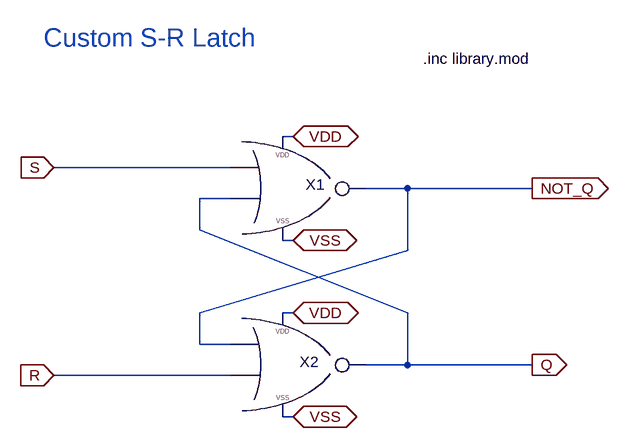
[diagram p0: schematic my_sr_latch.asc]
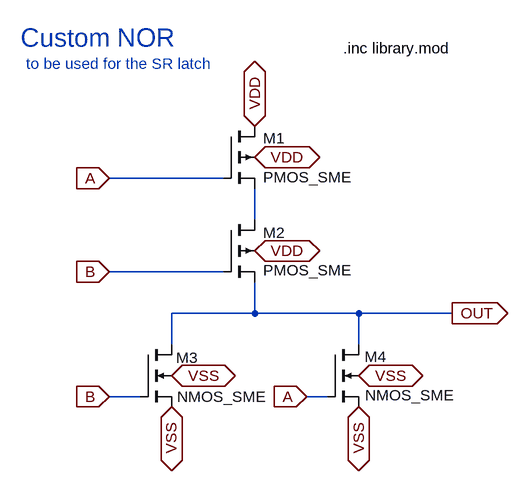
[diagram p1: sub-circuit my_nor.asc]
my_sr_latch.asc, the LTspice schematic file:
Version 4.1
SHEET 1 1044 728
WIRE 352 192 336 192
WIRE 256 240 -16 240
WIRE 528 272 464 272
WIRE 720 272 528 272
WIRE 256 288 208 288
WIRE 208 336 208 288
WIRE 352 352 336 352
WIRE 528 368 528 272
WIRE 208 464 528 368
WIRE 352 464 336 464
WIRE 528 464 208 336
WIRE 208 512 208 464
WIRE 256 512 208 512
WIRE 528 544 528 464
WIRE 528 544 464 544
WIRE 720 544 528 544
WIRE 256 560 -16 560
WIRE 352 624 336 624
FLAG -16 240 S
IOPIN -16 240 In
FLAG -16 560 R
IOPIN -16 560 In
FLAG 720 544 Q
IOPIN 720 544 Out
FLAG 720 272 NOT_Q
IOPIN 720 272 Out
FLAG 352 192 VDD
IOPIN 352 192 BiDir
FLAG 352 624 VSS
IOPIN 352 624 BiDir
FLAG 352 352 VSS
IOPIN 352 352 BiDir
FLAG 352 464 VDD
IOPIN 352 464 BiDir
SYMBOL my_nor 352 272 R0
WINDOW 0 34 10 Bottom 2
SYMATTR InstName X1
SYMBOL my_nor 352 544 R0
WINDOW 0 25 11 Bottom 2
SYMATTR InstName X2
TEXT -32 40 Left 4 ;Custom S-R Latch
TEXT 552 72 Left 2 !.inc library.mod

my_nor.asc, the sub-circuit schematic file:
Version 4.1
SHEET 1 880 780
WIRE 256 240 80 240
WIRE 304 304 304 256
WIRE 256 384 80 384
WIRE 304 448 304 400
WIRE 304 448 176 448
WIRE 464 448 304 448
WIRE 608 448 464 448
WIRE 176 496 176 448
WIRE 464 496 464 448
WIRE 128 576 80 576
WIRE 416 576 384 576
FLAG 80 240 A
IOPIN 80 240 In
FLAG 80 384 B
IOPIN 80 384 In
FLAG 608 448 OUT
IOPIN 608 448 Out
FLAG 176 592 VSS
IOPIN 176 592 BiDir
FLAG 464 592 VSS
IOPIN 464 592 BiDir
FLAG 464 544 VSS
IOPIN 464 544 BiDir
FLAG 176 544 VSS
IOPIN 176 544 BiDir
FLAG 304 160 VDD
IOPIN 304 160 BiDir
FLAG 304 208 VDD
IOPIN 304 208 BiDir
FLAG 304 352 VDD
IOPIN 304 352 BiDir
FLAG 80 576 B
IOPIN 80 576 In
FLAG 384 576 A
IOPIN 384 576 In
SYMBOL pmos4 256 160 R0
WINDOW 0 61 19 Left 2
WINDOW 3 61 79 Left 2
SYMATTR InstName M1
SYMATTR Value PMOS_SME
SYMATTR Value2 l=0.35u w=0.4u
SYMBOL pmos4 256 304 R0
WINDOW 0 61 20 Left 2
WINDOW 3 61 78 Left 2
SYMATTR InstName M2
SYMATTR Value PMOS_SME
SYMATTR Value2 l=0.35u w=0.4u
SYMBOL nmos4 128 496 R0
WINDOW 0 55 20 Left 2
WINDOW 3 57 80 Left 2
SYMATTR InstName M3
SYMATTR Value NMOS_SME
SYMATTR Value2 l=0.35u w=0.4u
SYMBOL nmos4 416 496 R0
WINDOW 0 57 19 Left 2
WINDOW 3 58 78 Left 2
SYMATTR InstName M4
SYMATTR Value NMOS_SME
SYMATTR Value2 l=0.35u w=0.4u
TEXT -56 24 Left 4 ;Custom NOR
TEXT 440 40 Left 2 !.inc library.mod
TEXT -48 64 Left 2 ;to be used for the SR latch

The netlist it stands for:
* my_sr_latch.asc
X§X1 S Q NOT_Q VDD VSS my_nor
X§X2 NOT_Q R Q VDD VSS my_nor

* block symbol definitions
.subckt my_nor A B OUT VDD VSS
M1 VDD A N001 VDD PMOS_SME l=0.35u w=0.4u
M2 N001 B OUT VDD PMOS_SME l=0.35u w=0.4u
M3 OUT B VSS VSS NMOS_SME l=0.35u w=0.4u
M4 OUT A VSS VSS NMOS_SME l=0.35u w=0.4u
* Custom NOR
.inc library.mod
* to be used for the SR latch
.ends my_nor

.model NMOS NMOS
.model PMOS PMOS
.lib standard.mos
* Custom S-R Latch
.inc library.mod
.backanno
.end